# Altium schematic sheet button_input.SchDoc
size 431 x 279 mm; Author: Shivam Sharma; SheetNumber: 10; SheetTotal: 14
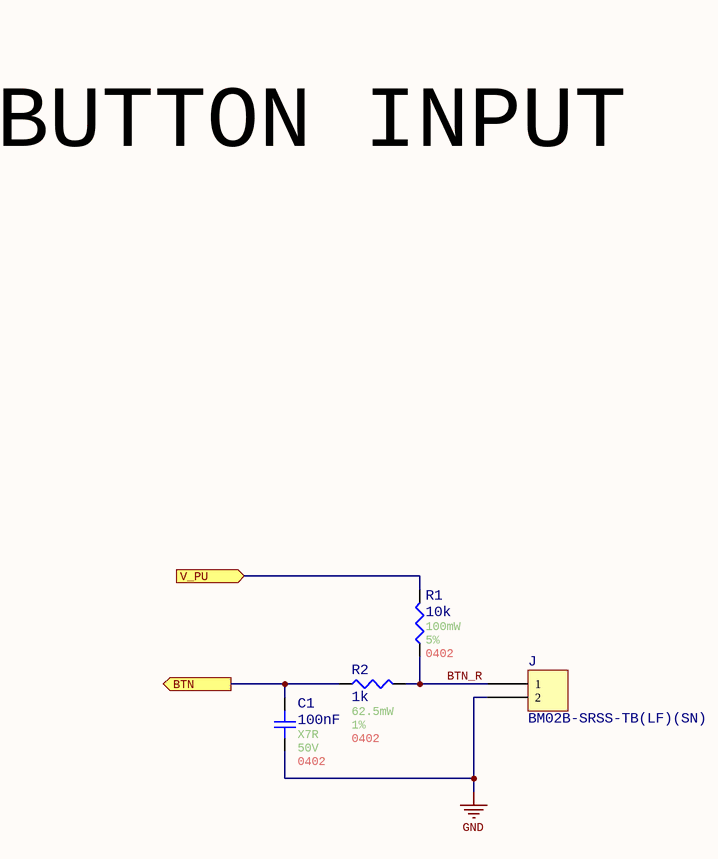
[diagram p0: button_input.SchDoc]

## Parts
C1  value 100nF  Temperature Coefficient: X7R  Voltage Rating: 50V  Case/Package: 0402  [Generic 0402 capacitor]  (hidden comment: GRT155R71H104KE01D)
J  BM02B-SRSS-TB(LF)(SN)  [JST BM02B-SRSS-TB]
R1  value 10k  Power: 100mW  Tolerance: 5%  Case/Package: 0402  [Generic 0402 Resistor]  (hidden comment: ERJ-2GEJ103X)
R2  value 1k  Power: 62.5mW  Tolerance: 1%  Case/Package: 0402  [Generic 0402 Resistor]  (hidden comment: WR04X1001FTL)

## Ports
BTN (out), V_PU (in)

## Nets
GND: C1.1 J.2
BTN: C1.2 R2.1 ; port BTN
BTN_R: J.1 R1.1 R2.2
V_PU: R1.2 ; port V_PU

## Notes on the sheet
- BUTTON INPUT
- Title:
- Author:
- Approved:
- Size:
- Date:
- Git Hash:
- Sch Revision:
- B
- Prj:
- SCH PN:
- Variant:
- Edited:
- CONFIDENTIAL
- File:

## Library data of the parts
C1 = CMP-001-00084-12: Ceramic Capacitor, Multilayer, Ceramic, 50V, 10% +Tol, 10% -Tol, X7R, 15% TC, 0.1uF, Surface Mount, 0402; Multilayer: Yes; Terminal Finish: Nickel; Capacitor Type: Ceramic; Package Shape: Rectangular; Reach SVHC Compliant: Yes; Max Operating Temperature: 125°C; RoHS Compliant: Yes; Termination: Wraparound; Packaging: Tape and Reel; AECQ: Yes; Pins: 2; Dielectric Material: Ceramic; Min Operating Temperature: -55°C; Tolerance: 10%; Mounting Technology: Surface Mount
J = BM02B-SRSS-TB(LF)(SN): CONN HEADER SMD 2POS 1MM; Manufacturer: JST Sales America Inc.; Current Rating (Amps): 0.7A; Material Flammability Rating: UL94 V-0; Number of Positions: 2; Number of Positions Loaded: All; Pitch - Mating: 0.039" (1.00mm); Shrouding: Shrouded - 4 Wall; Style: Board to Cable/Wire; Voltage Rating: 50V; Part Number: BM02B-SRSS-TB(LF)(SN); ComponentLink1Description: Datasheet; ComponentLink1URL: http://www.jst-mfg.com/product/pdf/eng/eSR.pdf; ComponentLink2Description: DigiKey Link; ComponentLink2URL: http://digikey.com/product-detail/en/jst-sales-america-inc/BM02B-SRSS-TB-LF-SN/455-1788-1-ND/926859; Connector Type: Header; Contact Finish - Mating: Tin; Contact Finish - Post: Tin; Contact Material: Copper Alloy; Contact Shape: Square; Contact Type: Male Pin; Fastening Type: Push-Pull; Features: Solder Retention; Insulation Color: Natural; Insulation Height: 0.167" (4.25mm); Insulation Material: Polyamide (PA), Nylon; LastUpdated: 1/12/2020 10:11:04 PM; Lifecycle Status: Active; Minimum Order: 1; Mounting Type: Surface Mount; Number of Rows: 1; Operating Temperature: -25°C ~ 85°C; Packaging: TapeAndReel; PartId: 12; Part Status: Active; Price: 0.22; Series: SR; Supplier 1: DigiKey; Supplier Part Number 1: 455-1788-1-ND; Termination: Solder
R1 = CMP-009-00185-9: Res Thick Film 0402 10K Ohm 5% 1/10W ±200ppm/°C Molded SMD Punched Carrier T/R; AECQ: No; Mounting Technology: Surface Mount; Max Operating Temperature: 155°C; Min Operating Temperature: -55°C; RoHS Compliant: Yes; Pins: 2
R2 = CMP-009-00182-8: Fixed Resistor, Metal Glaze/thick Film, 0.0625W, 1000ohm, 50V, 1% +/-Tol, 100ppm/Cel, Surface Mount, 0402; Manufacturer Part Number: Blank; AECQ: No; Package Height: 0.35mm; Additional Feature: LASER TRIMMABLE; Rated Temperature: 70°C; Package Length: 1mm; Temperature Coefficient (ppm/Cel): 100; Package Width: 0.5mm; RoHS Compliant: Yes; Technology: METAL GLAZE/THICK FILM; Max Operating Temperature: 155°C; Mounting Technology: Surface Mount; JESD-609 Code: e3; Terminal Finish: Nickel; Working Voltage: 50V; Min Operating Temperature: -55°C; Pins: 2; Reach SVHC Compliant: Yes; Termination: Wraparound; Resistor Type: FIXED RESISTOR; Packaging: Tape and Reel; Package Shape: Rectangular; Construction: Chip